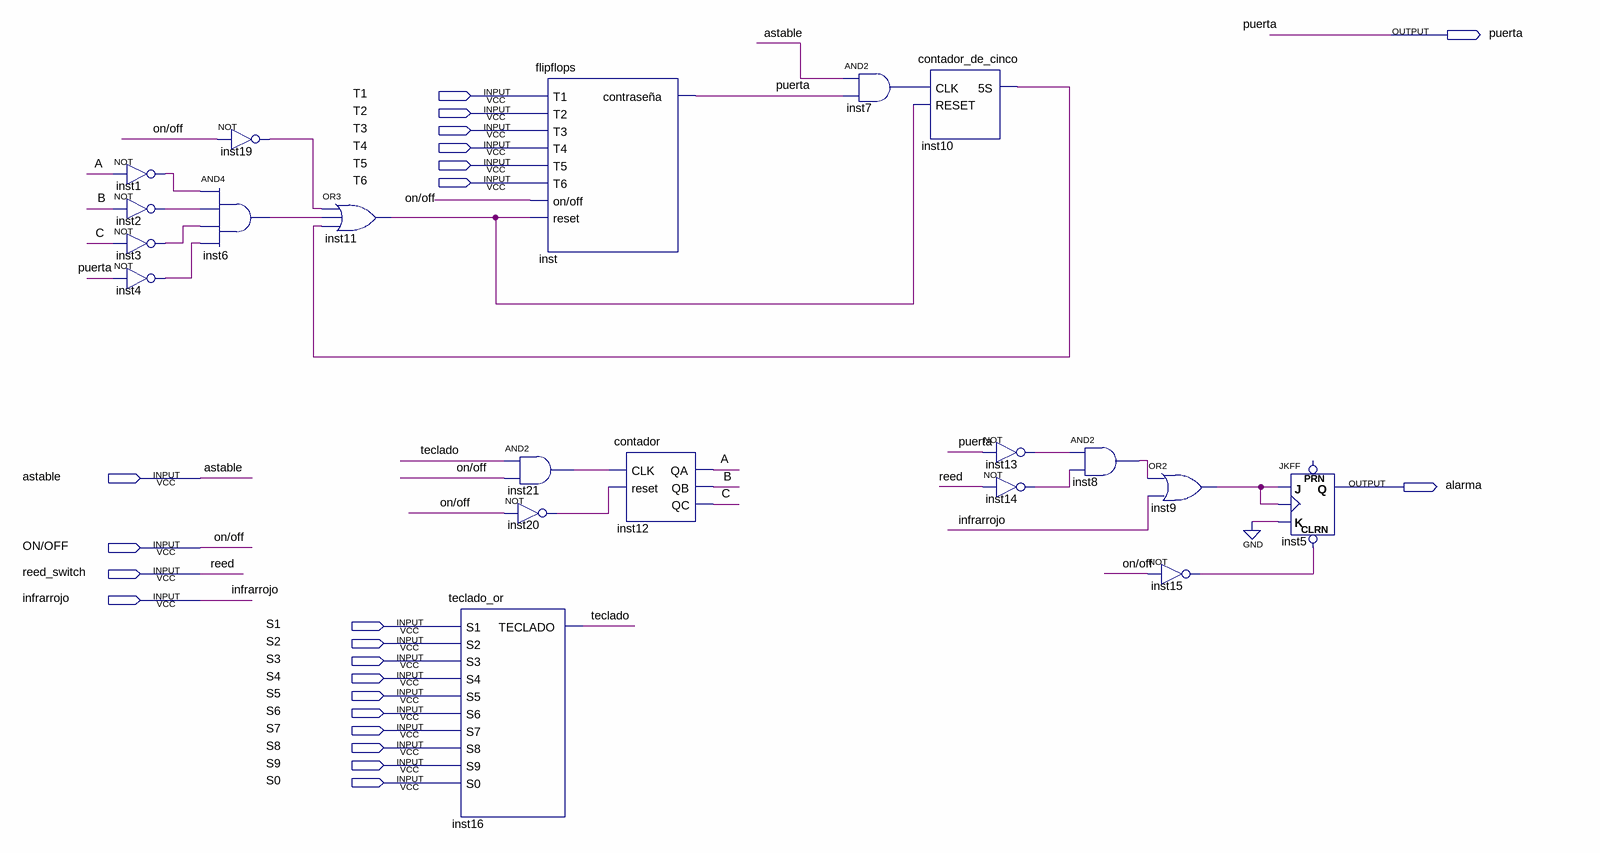
[diagram p0: schematic sheet]
// Quartus schematic esquematico.bdf as structural Verilog: 20 symbols, 22 pins
module esquematico (
  input  T1,
  input  T2,
  input  T3,
  input  T4,
  input  T5,
  input  T6,
  input  astable,
  input  \ON/OFF ,
  input  reed_switch,
  input  infrarrojo,
  input  S1,
  input  S2,
  input  S3,
  input  S4,
  input  S5,
  input  S6,
  input  S7,
  input  S8,
  input  S9,
  input  S0,
  output puerta,
  output alarma
);

  wire A, B, C, inst1_out, inst2_out, inst3_out, inst4_out, inst6_out, inst7_out, inst8_out, inst9_out,
       inst10_5s, inst11_out, inst13_out, inst14_out, inst15_out, inst19_out, inst20_out, inst21_out, teclado;

  not inst1 (inst1_out, A);
  not inst2 (inst2_out, B);
  not inst3 (inst3_out, C);
  not inst4 (inst4_out, puerta);
  not inst19 (inst19_out, \ON/OFF );
  and inst6 (inst6_out, inst1_out, inst2_out, inst3_out, inst4_out);
  or inst11 (inst11_out, inst19_out, inst6_out, inst10_5s);
  teclado_or inst16 (
    .S1(S1), .S2(S2), .S3(S3), .S4(S4), .S5(S5), .S6(S6), .S7(S7), .S8(S8), .S9(S9), .S0(S0),
    .TECLADO(teclado));
  flipflops inst (
    .T1(T1), .T2(T2), .T3(T3), .T4(T4), .T5(T5), .T6(T6), .\on/off (\ON/OFF ), .reset(inst11_out),
    .\contraseña (puerta));
  and inst21 (inst21_out, teclado, \ON/OFF );
  not inst20 (inst20_out, \ON/OFF );
  contador inst12 (.CLK(inst21_out), .reset(inst20_out), .QA(A), .QB(B), .QC(C));
  and inst7 (inst7_out, astable, puerta);
  contador_de_cinco inst10 (.CLK(inst7_out), .RESET(inst11_out), .\5S (inst10_5s));
  not inst13 (inst13_out, puerta);
  not inst14 (inst14_out, reed_switch);
  and inst8 (inst8_out, inst13_out, inst14_out);
  or inst9 (inst9_out, inst8_out, infrarrojo);
  not inst15 (inst15_out, \ON/OFF );
  JKFF inst5 (.CLRN(inst15_out), .K(1'b0), .J(inst9_out), .CLK(inst9_out), .Q(alarma));  // open: PRN

  // Other names for the same wires on the sheet: reed = reed_switch
endmodule
